# EAGLE design schemat2 (EAGLE 9.4.2)
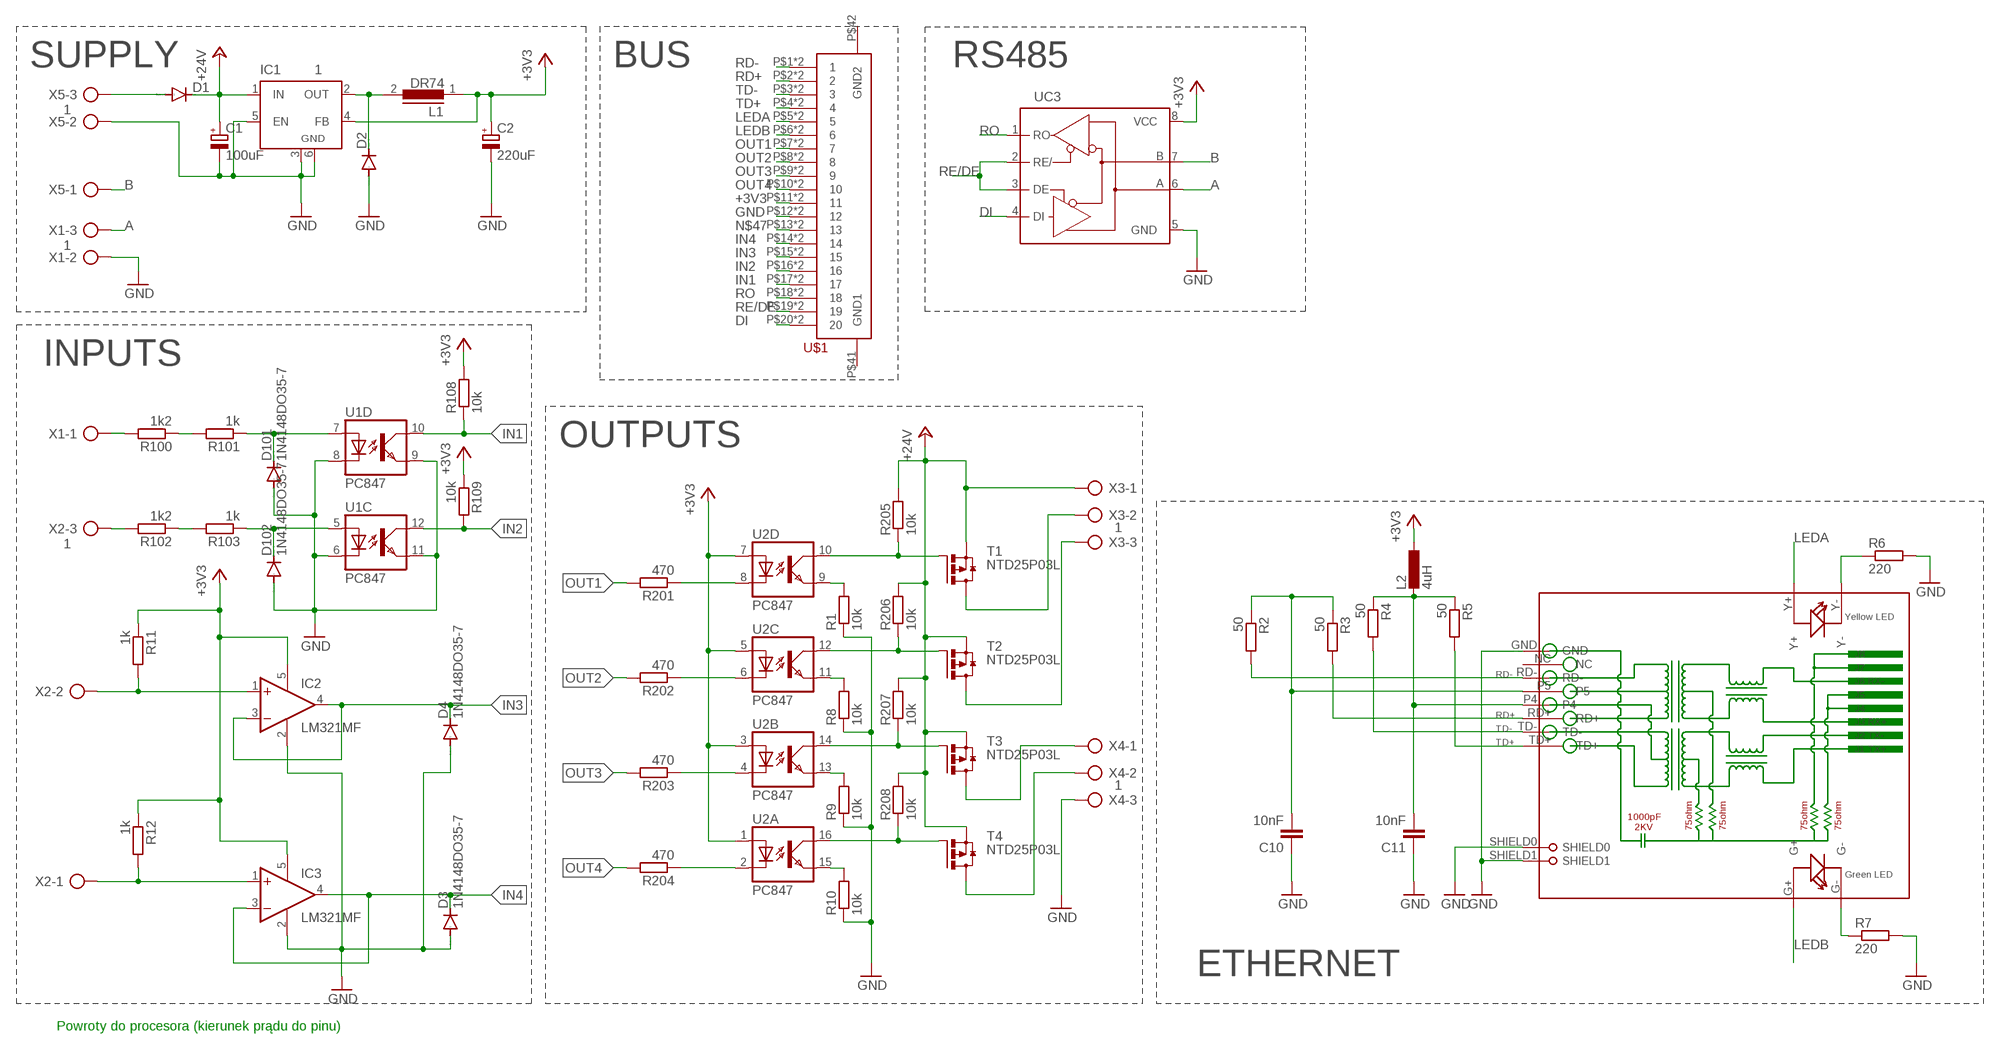
[diagram p0: schematic, sheet 1]

## Parts
C1  100uF  CPOL-EUSANYO_SMD_E7  [SANYO-OSCON_SMD_E7]
C2  220uF  CPOL-EUSANYO_SMD_E7  [SANYO-OSCON_SMD_E7]
C10  10nF  C-0805  [C0805]
C11  10nF  C-0805  [C0805]
D1  S1M  [SMA]
D2  S1M  [SMA]
D3  1N4148DO35-7  [DO35-7]
D4  1N4148DO35-7  [DO35-7]
D101  1N4148DO35-7  [DO35-7]
D102  1N4148DO35-7  [DO35-7]
IC1  1  LM2596S  [TO263-5]
IC2  LM321MF  [SOT23-5]
IC3  LM321MF  [SOT23-5]
L1  DR74  [DR74]
L2  4uH  L-EUL2012C  [L2012C]
R1  10k  R-0805W  [R0805W]
R2  50  R-0805  [R0805]
R3  50  R-0805  [R0805]
R4  50  R-0805  [R0805]
R5  50  R-0805  [R0805]
R6  220  R-0805  [R0805]
R7  220  R-0805  [R0805]
R8  10k  R-0805W  [R0805W]
R9  10k  R-0805W  [R0805W]
R10  10k  R-0805W  [R0805W]
R11  1k  R-0805  [R0805]
R12  1k  R-0805  [R0805]
R100  1k2  R-0805  [R0805]
R101  1k  R-0805  [R0805]
R102  1k2  R-0805  [R0805]
R103  1k  R-0805  [R0805]
R108  10k  R-0805  [R0805]
R109  10k  R-0805  [R0805]
R201  470  R-0805  [R0805]
R202  470  R-0805  [R0805]
R203  470  R-0805  [R0805]
R204  470  R-0805  [R0805]
R205  10k  R-0805W  [R0805W]
R206  10k  R-0805W  [R0805W]
R207  10k  R-0805W  [R0805W]
R208  10k  R-0805W  [R0805W]
RJ1  HR911105A  [HR911105A]
T1  NTD25P03L  [DPACK]
T2  NTD25P03L  [DPACK]
T3  NTD25P03L  [DPACK]
T4  NTD25P03L  [DPACK]
U1  PC847  [SO16]
U2  PC847  [SO16]
U$1  FFC(FPC)_ZIF_20_PINV  [PCA-2C-20-V-3]
UC3  MAX3468CSA  [SO08]
X1  1  AK500/3  [AK500/3]
X2  1  AK500/3  [AK500/3]
X3  1  AK500/3  [AK500/3]
X4  1  AK500/3  [AK500/3]
X5  1  AK500/3  [AK500/3]

## Nets
+3V3: C2.+ IC1.4(FB) IC2.5(V+) IC3.5(V+) L1.1 L2.1 R11.1 R12.1 R108.2 R109.1 U2.1(A:A) U2.3(B:A) U2.5(C:A) U2.7(D:A) U$1.P$11 U$1.P$31 UC3.8(VCC)
+24V: C1.+ D1.C IC1.1(IN) R205.2 R206.2 R207.2 R208.2 T1.3(S) T2.3(S) T3.3(S) T4.3(S) X3.1
A: UC3.6(A) X1.3
B: UC3.7(B) X5.1
DI: U$1.P$20 U$1.P$40 UC3.4(DI)
GND: C1.- C2.- C10.1 C11.1 D2.A D3.A D4.A D101.A D102.A IC1.3(GND) IC1.5(EN) IC1.6(GND) IC2.2(V-) IC3.2(V-) R1.1 R6.2 R7.2 R8.1 R9.1 R10.1 RJ1.GND RJ1.SHIELD0 RJ1.SHIELD1 U1.6(C:C) U1.8(D:C) U1.9(D:EMIT) U1.11(C:EMIT) U$1.P$12 U$1.P$32 UC3.5(GND) X1.2 X4.3 X5.2
IN1: R108.1 U1.10(D:COL) U$1.P$17 U$1.P$37
IN2: R109.2 U1.12(C:COL) U$1.P$16 U$1.P$36
IN3: D4.C IC2.3(-IN) IC2.4(OUT) U$1.P$15 U$1.P$35
IN4: D3.C IC3.3(-IN) IC3.4(OUT) U$1.P$14 U$1.P$34
LEDA: RJ1.Y+ U$1.P$5 U$1.P$25
LEDB: RJ1.G+ U$1.P$6 U$1.P$26
N$1: R100.1 R101.2
N$2: R100.2 X1.1
N$3: R205.1 T1.1(G) U2.10(D:COL)
N$4: R206.1 T2.1(G) U2.12(C:COL)
N$5: D1.A X5.3
N$6: R207.1 T3.1(G) U2.14(B:COL)
N$7: R208.1 T4.1(G) U2.16(A:COL)
N$8: R102.2 X2.3
N$9: IC3.1(+IN) R12.2 X2.1
N$10: T1.2(D) X3.2
N$11: T2.2(D) X3.3
N$12: T3.2(D) X4.1
N$13: T4.2(D) X4.2
N$14: R102.1 R103.2
N$15: IC2.1(+IN) R11.2 X2.2
N$20: R201.1 U2.8(D:C)
N$21: R202.1 U2.6(C:C)
N$22: D101.C R101.1 U1.7(D:A)
N$23: D102.C R103.1 U1.5(C:A)
N$24: D2.C IC1.2(OUT) L1.2
N$25: R203.1 U2.4(B:C)
N$26: R204.1 U2.2(A:C)
N$27: R1.2 U2.9(D:EMIT)
N$28: R8.2 U2.11(C:EMIT)
N$29: R9.2 U2.13(B:EMIT)
N$30: R10.2 U2.15(A:EMIT)
N$35: C10.2 R2.1 R3.1 RJ1.P5
N$36: C11.2 L2.2 R4.1 R5.1 RJ1.P4
N$39: R6.1 RJ1.Y-
N$40: R7.1 RJ1.G-
N$47: U$1.P$13 U$1.P$33
OUT1: R201.2 U$1.P$7 U$1.P$27
OUT2: R202.2 U$1.P$8 U$1.P$28
OUT3: R203.2 U$1.P$9 U$1.P$29
OUT4: R204.2 U$1.P$10 U$1.P$30
RD+: R3.2 RJ1.RD+ U$1.P$2 U$1.P$22
RD-: R2.2 RJ1.RD- U$1.P$1 U$1.P$21
RE/DE: U$1.P$19 U$1.P$39 UC3.2(RE/) UC3.3(DE)
RO: U$1.P$18 U$1.P$38 UC3.1(RO)
TD+: R5.2 RJ1.TD+ U$1.P$4 U$1.P$24
TD-: R4.2 RJ1.TD- U$1.P$3 U$1.P$23
Unconnected: RJ1.NC U1.1(A:A) U1.2(A:C) U1.3(B:A) U1.4(B:C) U1.13(B:EMIT) U1.14(B:COL) U1.15(A:EMIT) U1.16(A:COL) U$1.P$41(GND1) U$1.P$42(GND2)

## Notes on the sheet
- SUPPLY | BUS | RS485
- INPUTS
- OUTPUTS
- ETHERNET
- Powroty do procesora (kierunek prądu do pinu)

## Library data of the parts
C1 C2 = rcl:CPOL-EU: POLARIZED CAPACITOR, European symbol; SPICEPREFIX: C
C10 C11 = devport001:C-0805: Kondensator SMD w obudowie 0805
D1 D2 = diode:S1M
D3 D4 D101 D102 = diode:1N4148: DIODE high speed (Philips)
IC1 = linear:LM2596S: STEP-DOWN VOLTAGE REGULATOR
IC2 IC3 = linear:LM321?*: Low Power Single Op Amp Source: http://cache.national.com/ds/LM/LM321.pdf
L1 = inductors:DR74: High Power Density, High Efficiency, Shielded Inductors Source: coiltronics_dr_series.pdf; SPICEPREFIX: L
L2 = rcl:L-EU: INDUCTOR, European symbol
R1-R12 R100-R103 R108 R109 R201-R208 = devport001:R-0805: Rezystor SMD w obudowie 0805
RJ1 = CONNECTER:HR911105A
T1-T4 = devport001:NTD25P03L
U1 U2 = devport001:PC847
U$1 = devport001:FFC(FPC)_ZIF_20_PIN
UC3 = maxim:MAX34*: +5V, Fail-Safe, 40Mbps, Profibus RS-485/RS-422 Transceivers Source: MAX3465-MAX3469.pdf; MPN: MAX3468CSA+; OC_FARNELL: unknown; OC_NEWARK: 76K6721
X1-X5 = con-ptr500:AK500/3: CONNECTOR; OC_FARNELL: unknown; OC_NEWARK: unknown

## Board
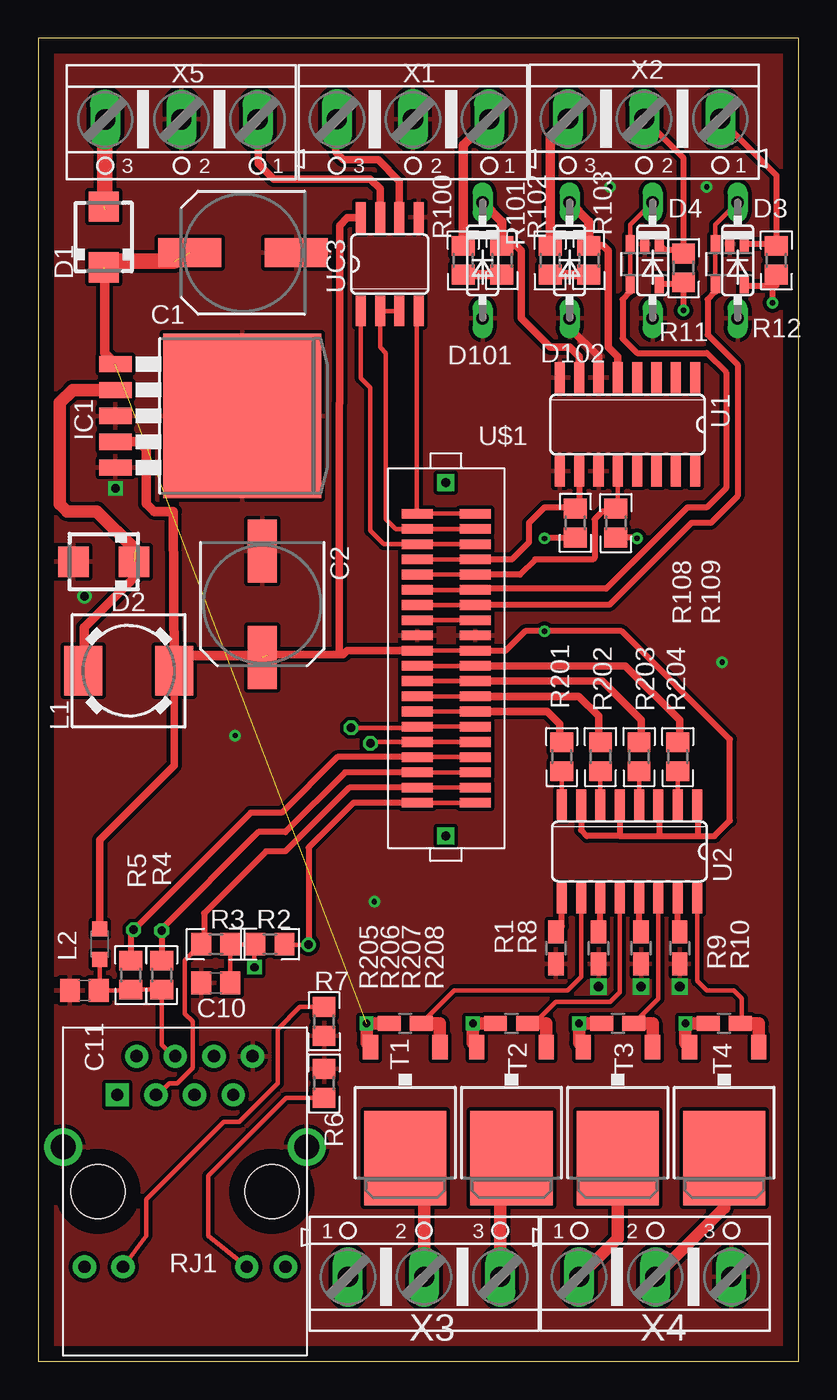
[diagram p1: board, top side]
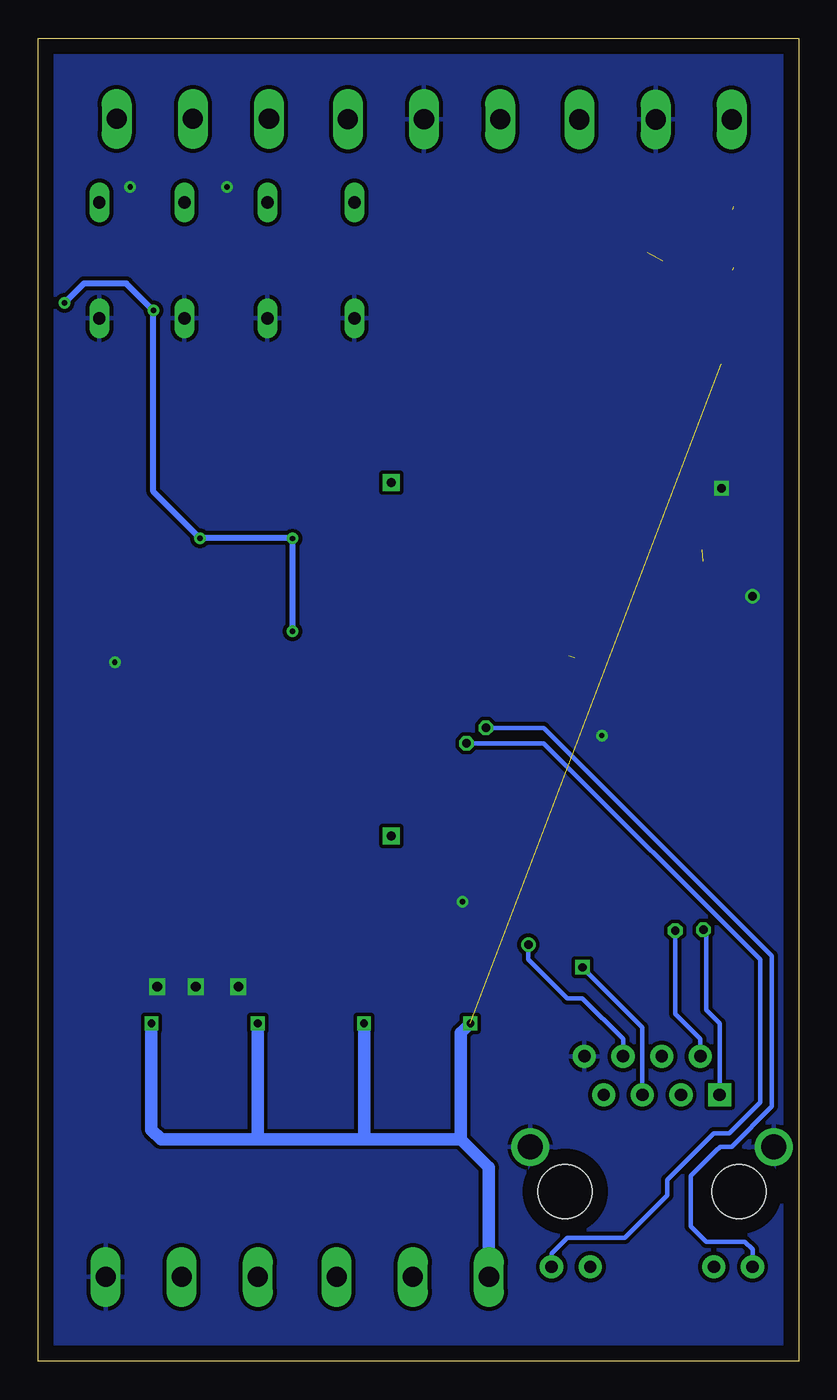
[diagram p2: board, bottom side, seen from below]

Size 50 x 87 mm. Coordinates in mm from the lower left corner, seen from the top.
Outline: 0,0 50,0 50,87 0,87 0,0
Copper layers (1*16): Top 0.035mm / dielectric 1.5mm / Bottom 0.035mm
Design rules "default *": minimum track width 10mil, minimum drill 0.35mm, track to track 8mil, track to pad 8mil, pad to pad 8mil, via to via 8mil, smd to smd 8mil, copper to edge 40mil, drill to drill 10mil, minimum pad ring 10mil, minimum via ring 8mil, stop-mask expansion 4mil, vias tented up to drill 0mil, thermal gap 10mil

### Footprints (pad centres in the part's own frame; a part is rotated, then mirrored left to right if it is on the bottom)
SANYO-OSCON_SMD_E7 = smd 4.15 x 1.9: + 3.5,0; - -3.5,0
C0805 = smd 1.3 x 1.5: 1 -0.95,0; 2 0.95,0
SMA = smd 2 x 2: A 2,0; C -2,0
DO35-7 = drill 0.813 long: A 3.81,0; C -3.81,0
TO263-5 = smd 1.067 x 2.159: 1 -3.404,-5.791; 2 -1.702,-5.791; 3 0,-5.791; 4 1.702,-5.791; 5 3.404,-5.791 | smd 10.8 x 10.41: 6 0,2.54
SOT23-5 = smd 0.6 x 1.2: 1 -0.95,-1.306; 2 0,-1.306; 3 0.95,-1.306; 4 0.95,1.306; 5 -0.95,1.306
DR74 = smd 2.5 x 3.25: 1 -3,0; 2 3,0
L2012C = smd 1 x 1: 1 -1,0; 2 1,0
R0805W = smd 1.5 x 1: 1 -1.052,0; 2 1.052,0
R0805 = smd 1.3 x 1.5: 1 -0.95,0; 2 0.95,0
HR911105A = drill 0.813 pad 1.524: G+ 4.953,-6.604; G- 4.953,-4.064; GND -8.89,4.445; NC -6.35,3.175; P4 -8.89,-0.635; P5 -6.35,0.635; RD+ -6.35,-1.905; RD- -8.89,1.905; TD- -8.89,-3.175; Y+ 4.953,6.604; Y- 4.953,4.064 | drill 1.651 pad 2.159: SHIELD0 -2.921,8.001; SHIELD1 -2.921,-8.001 | drill 0.813 pad 1.524 square: TD+ -6.35,-4.445 | hole 3.556: 0,-5.715; 0,5.715
DPACK = smd 1 x 1.6: 1 -2.28,-6.07; 3 2.28,-6.07 | smd 5.4 x 6.2: 2 0,1.23
SO16 = smd 0.66 x 2.032: 1 -4.445,-3.073; 2 -3.175,-3.073; 3 -1.905,-3.073; 4 -0.635,-3.073; 5 0.635,-3.073; 6 1.905,-3.073; 7 3.175,-3.073; 8 4.445,-3.073; 9 4.445,3.073; 10 3.175,3.073; 11 1.905,3.073; 12 0.635,3.073; 13 -0.635,3.073; 14 -1.905,3.073; 15 -3.175,3.073; 16 -4.445,3.073
PCA-2C-20-V-3 = smd 2.032 x 0.635: P$1 -1.54,9.5; P$2 -1.54,8.5; P$3 -1.54,7.5; P$4 -1.54,6.5; P$5 -1.54,5.5; P$6 -1.54,4.5; P$7 -1.54,3.5; P$8 -1.54,2.5; P$9 -1.54,1.5; P$10 -1.54,0.5; P$11 -1.54,-0.5; P$12 -1.54,-1.5; P$13 -1.54,-2.5; P$14 -1.54,-3.5; P$15 -1.54,-4.5; P$16 -1.54,-5.5; P$17 -1.54,-6.5; P$18 -1.54,-7.5; P$19 -1.54,-8.5; P$20 -1.54,-9.5; P$21 2.27,9.5; P$22 2.27,8.5; P$23 2.27,7.5; P$24 2.27,6.5; P$25 2.27,5.5; P$26 2.27,4.5; P$27 2.27,3.5; P$28 2.27,2.5; P$29 2.27,1.5; P$30 2.27,0.5; P$31 2.27,-0.5; P$32 2.27,-1.5; P$33 2.27,-2.5; P$34 2.27,-3.5; P$35 2.27,-4.5; P$36 2.27,-5.5; P$37 2.27,-6.5; P$38 2.27,-7.5; P$39 2.27,-8.5; P$40 2.27,-9.5 | drill 0.6 square: P$41 0.381,11.684; P$42 0.381,-11.557
SO08 = smd 0.66 x 2.032: 1 -1.905,-3.073; 2 -0.635,-3.073; 3 0.635,-3.073; 4 1.905,-3.073; 5 1.905,3.073; 6 0.635,3.073; 7 -0.635,3.073; 8 -1.905,3.073
AK500/3 = drill 1.321 long: 1 -5.004,0; 2 0,0; 3 5.004,0

### Placement (x,y rotation side)
C1  13.46,72.9 180 top
C2  14.73,49.78 270 top
C10  11.68,24.89 0 top
C11  3.05,24.38 0 top
D1  4.32,73.91 90 top
D2  4.32,52.58 180 top
D3  45.97,72.39 270 top
D4  40.39,72.39 270 top
D101  29.21,72.39 270 top
D102  34.92,72.39 270 top
IC1  10.88,62.16 270 top
IC2  39.88,72.14 180 top
IC3  45.47,72.14 180 top
L1  5.96,45.41 180 top
L2  4.06,27.43 270 top
R1  34.04,27.18 90 top
R2  15.24,27.43 0 top
R3  11.68,27.43 180 top
R4  8.13,25.4 90 top
R5  6.1,25.4 90 top
R6  18.8,18.29 90 top
R7  18.8,22.35 270 top
R8  36.83,27.18 90 top
R9  39.62,27.18 90 top
R10  42.16,27.18 90 top
R11  42.42,71.88 90 top
R12  48.51,72.39 90 top
R100  27.94,72.39 90 top
R101  30.48,72.39 270 top
R102  33.66,72.39 90 top
R103  36.2,72.39 270 top
R108  35.31,55.12 270 top
R109  37.97,55.12 90 top
R201  34.42,39.75 90 top
R202  36.96,39.75 90 top
R203  39.5,39.75 90 top
R204  42.04,39.75 90 top
R205  24.13,22.23 180 top
R206  31.11,22.23 180 top
R207  38.1,22.23 180 top
R208  45.09,22.23 180 top
RJ1  9.65,11.18 270 top
T1  24.13,14.61 180 top
T2  31.11,14.61 180 top
T3  38.1,14.61 180 top
T4  45.09,14.61 180 top
U1  38.73,61.59 180 top
U2  38.86,33.53 180 top
U$1  27.18,46.23 180 top
UC3  23.11,72.14 0 top
X1  24.64,81.66 180 top
X2  39.83,81.69 180 top
X3  25.37,5.56 0 top
X4  40.56,5.56 0 top
X5  9.42,81.65 180 top

### Tracks (layer width: path | path; a pad name or v marks a point on that pad's centre or on a via)
+3V3  (via drill 0.35)  (1 unrouted)
  Top 0.305: U$1.P$31 U$1.P$11
  Top 0.406: U$1.P$11 30.73,46.74 32,48.01 v33.27,48.01 38.35,48.01 45.47,40.89 45.47,35.56 44.45,34.54 43.34,34.54 | v33.27,54.1 33.34,54.17 R108.2 | v39.36,54.11 39.3,54.17 R109.1 | v42.42,69.09 R11.1 42.32,70.83 IC2.5 | 48.26,70.73 v48.26,69.6 | R12.1 48.51,70.73 48.26,70.73 | IC3.5 46.52,70.73 48.26,70.73 | U2.7 35.69,34.92 36.07,34.54 38.24,34.54 | 40.83,34.54 43.34,34.54 | 38.24,34.54 40.83,34.54 | U2.1 43.34,36.57 43.34,34.54 | U2.3 40.83,36.54 40.83,34.54 | U2.5 38.24,36.59 38.24,34.54
  Top 0.508: U$1.P$31 20.31,46.73 20.07,46.48 19.79,46.48 | 19.79,46.48 15.2,46.48 15.11,46.4 | L2.1 4.06,34.29 8.96,39.18 L1.1 | UC3.8 21.18,75.18 20.32,75.18 19.81,74.68 19.81,62.99 19.79,62.97 19.79,46.48
  Top 0.61: IC1.4 6.6,60.46 7.11,59.94 7.11,56.39 7.62,55.88 8.9,55.88 L1.1 9.94,46.4 15.11,46.4
  Bottom 0.406: v33.27,48.01 v33.27,54.1 33.28,54.11 v39.36,54.11 42.42,57.17 v42.42,69.09 44.2,70.87 46.99,70.87 v48.26,69.6
+24V  (via drill 0.5)  (3 unrouted)
  Top 0.61: IC1.1 4.38,66.28 4.38,71.72
  Top 0.813: R208.2 v42.55,22.23 42.55,20.93 T4.3 | R207.2 v35.56,22.23 35.56,20.93 T3.3 | R206.2 v28.57,22.23 28.57,20.93 T2.3 | R205.2 v21.59,22.23 21.59,20.93 T1.3
  Top 1.016: 4.38,71.72 4.97,72.33 8.96,72.33
  Bottom 0.813: X3.1 20.37,12.75 22.23,14.61 | 22.23,14.61 28.57,14.61 | 28.57,14.61 35.56,14.61 | 35.56,14.61 41.91,14.61 42.55,15.24 v42.55,22.23 | 35.56,14.61 v35.56,22.23 | 28.57,14.61 v28.57,22.23 | 22.23,14.61 22.23,21.59 v21.59,22.23
A
  Top 0.508: X1.3 19.56,81.58 19.56,79.5 20.07,78.99 22.35,78.99 23.75,77.6 UC3.6
B
  Top 0.508: X5.1 14.48,81.6 14.48,78.74 15.49,77.72 21.84,77.72 22.48,77.09 UC3.7
DI
  Top 0.305: UC3.4 24.89,69.06 24.89,55.74 U$1.P$40 U$1.P$20
GND  (via drill 0.35, 0.55, 0.55 pad 0.65, 0.65)
  Top 0.508: U1.6 36.83,66.04 34.92,67.94 D102.A
  other vias: 5.08,57.4 3.05,50.29 36.83,24.64 39.62,24.64 42.16,24.64 22.1,30.23 12.95,41.15 44.96,45.97 37.59,77.22 43.94,77.22
  pour Top (isolate 0.254): -1.78,87.88 51.82,87.88 51.82,-1.52 -1.78,-1.52
  pour Bottom (isolate 0.254): -2.03,87.88 51.82,87.88 51.82,-1.78 -2.03,-1.78
IN1
  Top 0.305: U$1.P$37 U$1.P$17
  Top 0.406: U1.10 35.56,56.07 R108.1 35.24,56.13 33.27,56.13 32.26,55.12 32.26,53.85 31.14,52.73 U$1.P$17
IN2
  Top 0.305: U1.12 38.1,56.2 R109.2 | U$1.P$36 U$1.P$16
  Top 0.406: R109.2 37.78,55.88 37.08,55.88 36.58,55.37 36.58,52.83 36.47,52.73 32.66,52.73 31.66,51.73 U$1.P$16
IN3
  Top 0.305: U$1.P$35 U$1.P$15 | IC2.4 IC2.3 38.93,74.74 D4.C
  Top 0.406: IC2.4 38.93,70.32 38.42,69.81 38.42,67.24 39.37,66.29 43.94,66.29 45.21,65.02 45.21,57.4 43.94,56.13 42.67,56.13 37.34,50.8 28.79,50.8 U$1.P$15
IN4
  Top 0.305: U$1.P$34 U$1.P$14 | IC3.4 IC3.3 44.52,74.74 D3.C
  Top 0.406: 44.45,73.51 IC3.3 | IC3.4 44.52,70.32 44.01,69.81 44.01,67.5 45.97,65.53 45.97,56.9 44.2,55.12 42.93,55.12 37.54,49.73 U$1.P$14
LEDA  (via drill 0.55)
  Top 0.305: v21.84,40.64 21.93,40.73 U$1.P$25 U$1.P$5
  Bottom 0.305: RJ1.Y+ 16.26,7.11 15.24,8.13 11.43,8.13 8.64,10.92 8.64,11.94 5.59,14.99 4.57,14.99 2.54,17.02 2.54,26.42 16.76,40.64 v21.84,40.64
LEDB  (via drill 0.55)
  Top 0.305: v20.57,41.66 24.84,41.66 U$1.P$26 U$1.P$6
  Bottom 0.305: RJ1.G+ 3.05,7.37 3.56,7.87 6.1,7.87 7.11,8.89 7.11,12.19 5.33,13.97 5.31,13.97 5.16,14.12 4.42,14.12 1.78,16.76 1.78,26.67 16.76,41.66 v20.57,41.66
N$1
  Top 0.61: R100.1 R101.2
N$2
  Top 0.61: R100.2 27.94,79.96 X1.1
N$3
  Top 0.305: U2.10 35.69,25.27 34.8,24.38 27.34,24.38 R205.1
  Top 0.813: R205.1 26.41,22.23 T1.1
N$4
  Top 0.305: U2.12 38.23,24.26 37.59,23.62 34.01,23.62 32.61,22.23
  Top 0.813: T2.1 33.4,22.23 32.61,22.23 R206.1
N$5  (1 unrouted)
  Top 1.016: X5.3 4.38,81.61 4.38,75.72
N$6
  Top 0.305: U2.14 40.77,23.84 R207.1
  Top 0.813: R207.1 40.38,22.23 T3.1
N$7
  Top 0.305: U2.16 43.31,25.02 43.94,24.38 45.72,24.38 46.23,23.88 46.23,22.32 R208.1
  Top 0.813: T4.1 47.37,22.23 R208.1
N$8
  Top 0.61: R102.2 33.66,80.52 X2.3
N$9
  Top 0.406: IC3.1 48.41,73.44 R12.2 48.51,77.98 45.21,81.28 45.21,81.31 X2.1
N$10
  Top 0.813: T1.2 arc-90 25.37,12.13 X3.2
N$11
  Top 0.813: T2.2 arc90 30.37,12.63 X3.3
N$12
  Top 0.813: T3.2 38.1,8.1 X4.1
N$13
  Top 0.813: T4.2 45.09,10.09 X4.2
N$14
  Top 0.61: R102.1 R103.2
N$15
  Top 0.406: X2.2 42.42,79.1 42.42,73.09 | 42.42,73.09 R11.2 | IC2.1 41.18,73.09 42.42,73.09
N$20
  Top 0.305: U2.8 R201.1
N$21
  Top 0.305: U2.6 R202.1
N$22
  Top 0.508: R101.1 31.43,73.34 31.75,73.03 31.75,68.58 33.66,66.67 34.92,66.67 35.56,66.04 U1.7
  Top 0.61: D101.C 30.48,74.93 R101.1
N$23
  Top 0.508: R103.1 37.15,73.34 37.47,73.03 37.47,66.67 38.1,66.04 U1.5
  Top 0.61: D102.C 36.2,74.93 R103.1
N$24  (1 unrouted)
  Top 0.61: 6.38,53.36 6.38,51.6 3.05,48.26 3.05,45.5 L1.2
  Top 0.813: IC1.2 2.27,63.86 1.42,63.02 1.42,56.36 1.91,55.88 3.87,55.88 6.38,53.36
N$25
  Top 0.305: R203.1 U2.4
N$26
  Top 0.305: R204.1 U2.2
N$27
  Top 0.406: R1.2 34.42,28.61 U2.9
N$28
  Top 0.406: R8.2 36.96,28.36 U2.11
N$29
  Top 0.406: R9.2 39.5,28.36 U2.13
N$30
  Top 0.406: R10.2 42.04,28.36 U2.15
N$35  (via drill 0.55)
  Top 0.305: C10.2 R3.1 R2.1 14.22,27.37 v14.22,25.91
  Bottom 0.305: RJ1.P5 10.29,21.97 v14.22,25.91
N$36
  Top 0.305: 4.16,24.38 C11.2 | 4.16,24.38 6.03,24.38 R5.1 R4.1 8.13,20.83 8.89,20.07 RJ1.P4 | L2.2 4.06,24.48 4.16,24.38
N$39
  Top 0.305: RJ1.Y- 11.18,8.26 11.18,12.19 16.32,17.34 R6.1
N$40
  Top 0.305: RJ1.G- 7.11,8.26 7.11,10.67 12.19,15.75 13.21,15.75 15.75,18.29 15.75,21.84 17.21,23.3 R7.1
N$47
  Top 0.305: U$1.P$33 U$1.P$13
OUT1
  Top 0.305: U$1.P$27 U$1.P$7
  Top 0.508: R201.2 34.29,40.83 34.29,41.91 33.47,42.73 U$1.P$7
OUT2
  Top 0.305: U$1.P$28 U$1.P$8
  Top 0.508: R202.2 36.83,40.83 36.83,42.42 35.52,43.73 U$1.P$8
OUT3
  Top 0.305: U$1.P$29 U$1.P$9
  Top 0.508: R203.2 39.62,40.83 39.62,42.16 37.06,44.73 U$1.P$9
OUT4
  Top 0.305: U$1.P$30 U$1.P$10
  Top 0.508: R204.2 42.16,40.83 42.16,42.16 38.6,45.73 U$1.P$10
RD+
  Top 0.305: R3.2 9.65,26.35 9.65,22.86 10.16,22.35 10.16,19.3 9.14,18.29 8.64,18.29 7.87,17.53 RJ1.RD+ | U$1.P$2 U$1.P$22
  Top 0.406: U$1.P$22 20.46,37.73 16.26,33.53 14.99,33.53 10.92,29.46 10.92,27.62 R3.2
RD-  (via drill 0.55)
  Top 0.305: R2.2 16.23,27.39 v17.78,27.39 | U$1.P$21 U$1.P$1
  Top 0.406: U$1.P$21 20.73,36.73 17.78,33.78 v17.78,27.39
  Bottom 0.305: v17.78,27.39 17.78,26.42 15.24,23.88 14.22,23.88 11.56,21.21 RJ1.RD-
RE/DE
  Top 0.305: UC3.3 UC3.2 22.48,66.67 22.86,66.29 22.86,55.37 23.5,54.73 U$1.P$39 U$1.P$19
RO
  Top 0.305: UC3.1 21.21,64.64 21.84,64.01 21.84,54.61 22.73,53.73 U$1.P$38 U$1.P$18
TD+  (via drill 0.55)
  Top 0.305: U$1.P$24 U$1.P$4
  Top 0.406: U$1.P$24 19.66,39.73 16,36.07 13.97,36.07 v6.28,28.38 6.1,28.19 R5.2
  Bottom 0.305: RJ1.TD+ 5.21,22.23 6.1,23.11 6.1,28.19 v6.28,28.38
TD-  (via drill 0.55)
  Top 0.305: U$1.P$23 U$1.P$3
  Top 0.406: U$1.P$23 20.19,38.73 16.26,34.8 14.48,34.8 8.13,28.45 v8.13,28.32 R4.2
  Bottom 0.305: RJ1.TD- 6.48,21.21 8.13,22.86 v8.13,28.32